# EAGLE design ElectricalOutlet (EAGLE 9.3.0)
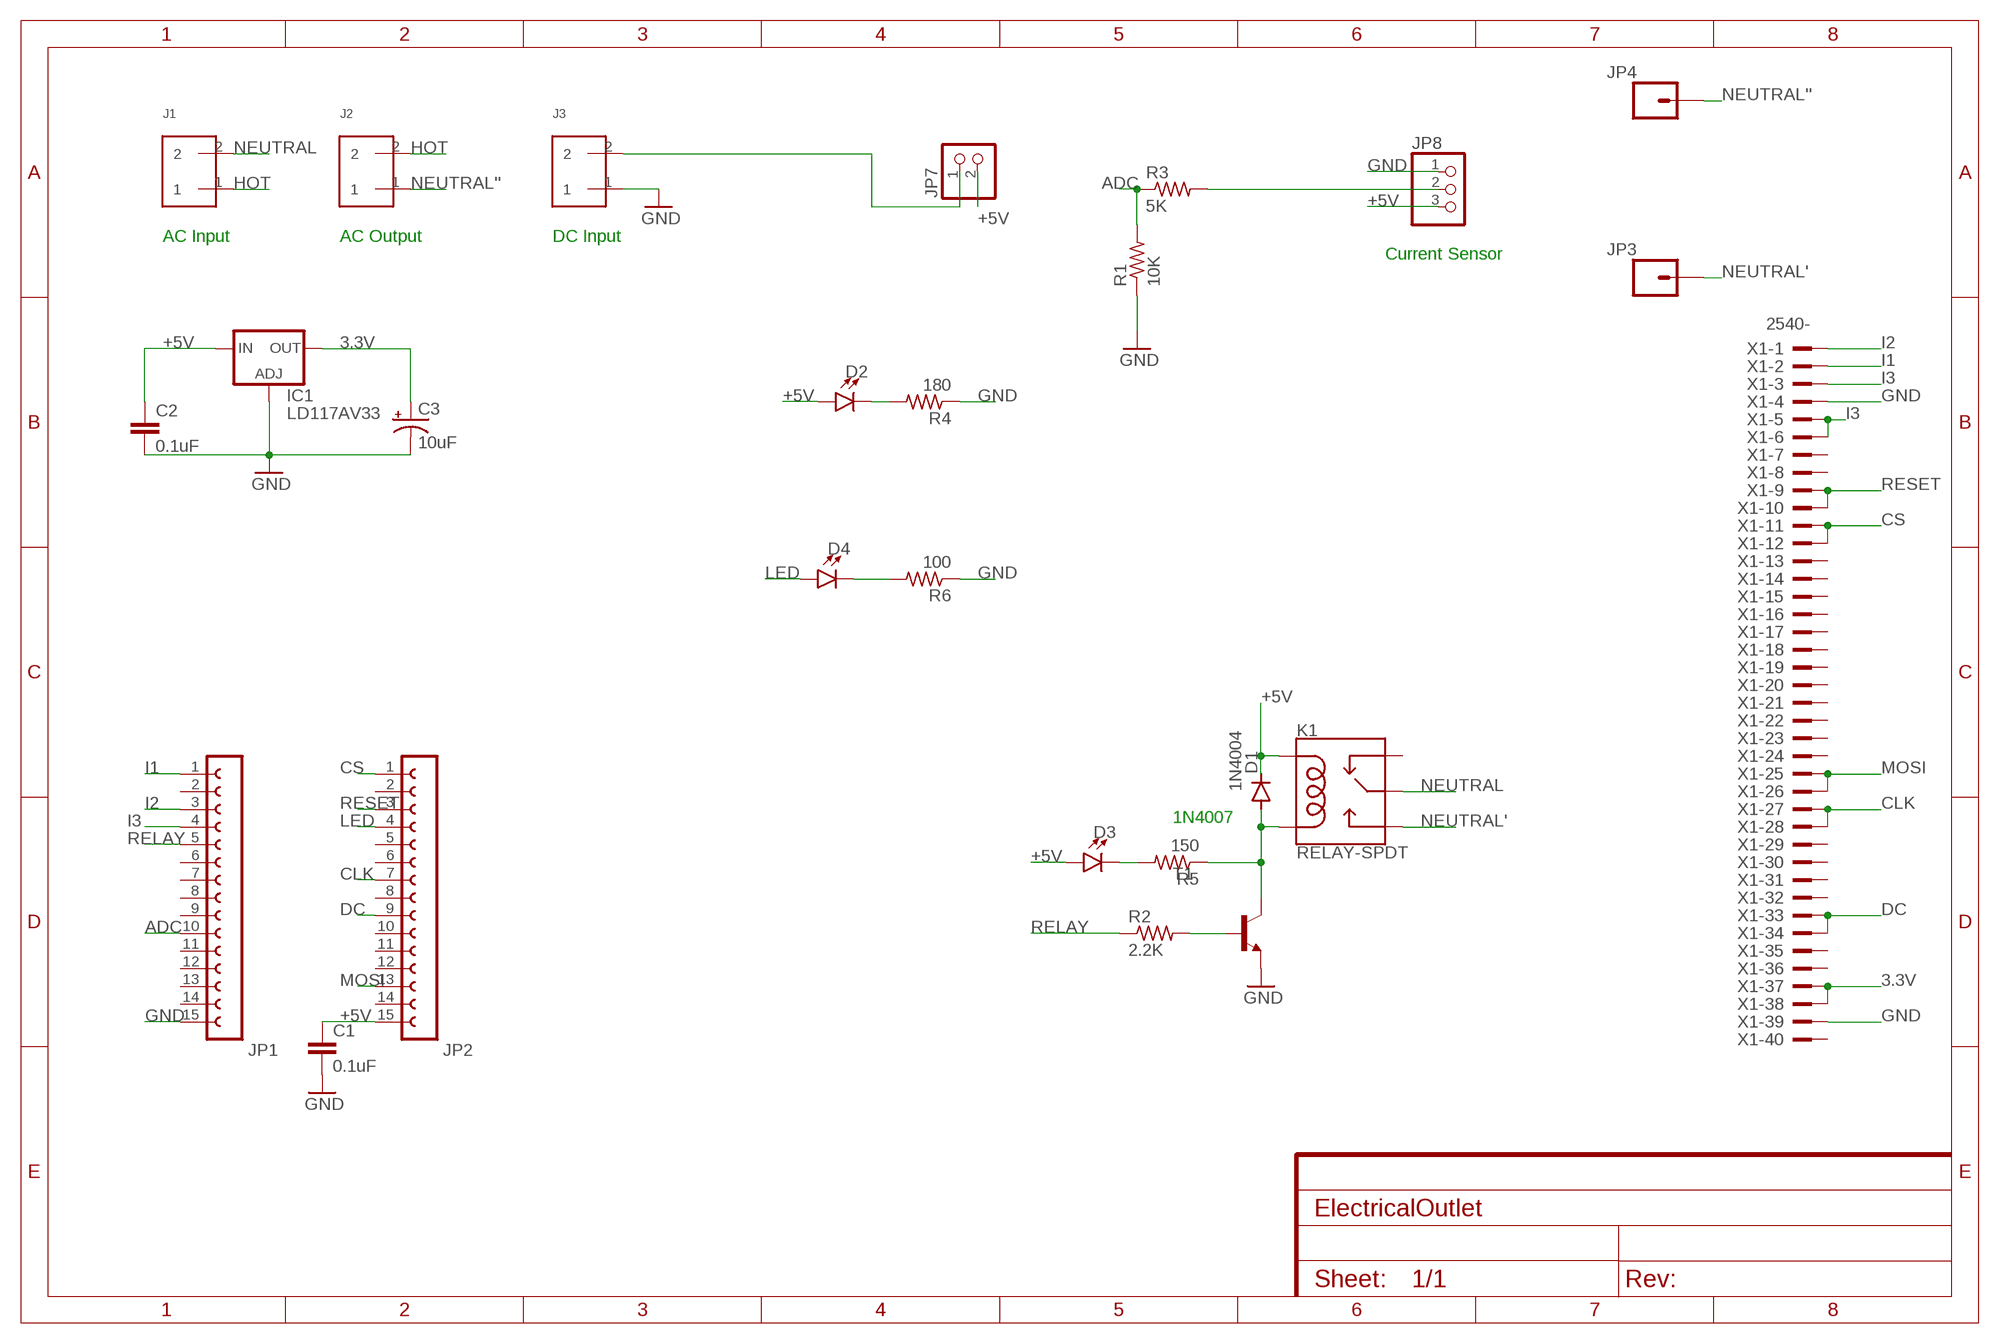
[diagram p0: schematic, sheet 1]

## Parts
C1  0.1uF  0.1UF-KIT-EZ-50V-20%  [CAP-PTH-SMALL-KIT]
C2  0.1uF  0.1UF-KIT-EZ-50V-20%  [CAP-PTH-SMALL-KIT]
C3  10uF  10UF-POLAR-RADIAL-2.5MM-KIT-25V-20%  [CPOL-RADIAL-2.5MM-5MM-KIT]
D1  1N4004  [DO41-10]
D2  LED3MM  [LED_3MM]
D3  LED3MM  [LED_3MM]
D4  LED3MM  [LED_3MM]
IC1  LD117AV33  [TO220L1]
J1  SCREW_TERMINAL  [PHEONIX-1935161]
J2  SCREW_TERMINAL  [PHEONIX-1935161]
J3  SCREW_TERMINAL  [PHEONIX-1935161]
JP1  FE15-1  [FE15]
JP2  FE15-1  [FE15]
JP3  CONN_01  [1X01]
JP4  CONN_01  [1X01]
JP7  PINHD-1X2  [1X02]
JP8  PINHD-1X3  [1X03]
K1  RELAY-SPDT  [RELAY_G5LE]
R1  10K  R-US_0204/7  [0204/7]
R2  2.2K  R-US_0204/7  [0204/7]
R3  5K  R-US_0204/7  [0204/7]
R4  180  R-US_0204/7  [0204/7]
R5  150  R-US_0204/7  [0204/7]
R6  100  R-US_0204/7  [0204/7]
T1  -NPN-TO92  [TO92]
X1  2540-  [PAK100/2500-40]

## Nets
3.3V: C3.1(+) IC1.2(OUT) X1.37 X1.38
+5V: C1.1 C2.1 D1.C D2.A D3.A IC1.3(IN) JP2.15 JP7.2 JP8.3 K1.2(COIL1)
ADC: JP1.10 R1.2 R3.1
CLK: JP2.7 X1.27 X1.28
CS: JP2.1 X1.11 X1.12
DC: JP2.9 X1.33 X1.34
GND: C1.2 C2.2 C3.2(-) IC1.1(ADJ) J3.1 JP1.15 JP8.1 R1.1 R4.1 R6.1 T1.1(E) X1.4 X1.39
HOT [AC]: J1.1 J2.2
I1: JP1.1 X1.2
I2: JP1.3 X1.1
I3: JP1.4 X1.3 X1.5 X1.6
LED: D4.A JP2.4
MOSI: JP2.13 X1.25 X1.26
N$2: D4.K(C) R6.2
N$3: R2.2 T1.2(B)
N$4: D3.K(C) R5.2
N$5: J3.2 JP7.1
N$6: D2.K(C) R4.2
N$7: JP8.2 R3.2
N$9: D1.A K1.5(COIL2) R5.1 T1.3(C)
NEUTRAL [AC]: J1.2 K1.1(MAIN)
NEUTRAL' [AC]: JP3.1 K1.3(NO)
NEUTRAL'' [AC]: J2.1 JP4.1
RELAY: JP1.5 R2.1
RESET: JP2.3 X1.9 X1.10
Unconnected: JP1.2 JP1.6 JP1.7 JP1.8 JP1.9 JP1.11 JP1.12 JP1.13 JP1.14 JP2.2 JP2.5 JP2.6 JP2.8 JP2.10 JP2.11 JP2.12 JP2.14 K1.4(NC) X1.7 X1.8 X1.13 X1.14 X1.15 X1.16 X1.17 X1.18 X1.19 X1.20 X1.21 X1.22 X1.23 X1.24 X1.29 X1.30 X1.31 X1.32 X1.35 X1.36 X1.40

## Notes on the sheet
- AC Input | AC Output | DC Input
- Current Sensor
- 1N4007

## Library data of the parts
C1 C2 = SparkFun-Capacitors:0.1UF: 0.1µF ceramic capacitors A capacitor is a passive two-terminal electrical component used to store electrical energy temporarily in an electric field.; PROD_ID: CAP-08370
C3 = SparkFun-Capacitors:10UF-POLAR: 10.0µF polarized capacitors A capacitor is a passive two-terminal electrical component used to store electrical energy temporarily in an electric field.; PROD_ID: CAP-08440
D1 = diode:1N4004: DIODE general purpose rectifier, 1 A
D2-D4 = SparkFun-LED:LED: LED (Generic) Standard schematic elements and footprints for 5mm, 3mm, 1206, and 0603 sized LEDs. Generic LEDs with no color specified.; PROD_ID: DIO-08794
IC1 = v-reg:LD117A?*: Low drop fixed and adjustable positive voltage regulators 1 A Source: http://www.st.com/stonline/products/literature/ds/7194/ld1117axx.pdf
J1-J3 = connector:SCREW_TERMINAL: PCB terminal block 5mm; DIGIKEY: 277-1667-ND
JP1 JP2 = con-lsta:FE15-1: FEMALE HEADER; OC_FARNELL: unknown; OC_NEWARK: unknown
JP3 JP4 = SparkFun-Connectors:CONN_01: Single connection point. Often used as Generic Header-pin footprint for 0.1 inch spaced/style header connections On any of the 0.1 inch spaced packages, you can populate with these: Break Away Headers - Straight <https://www.sparkfun.com/products/116> (PRT-00116) Break Away Male Headers - Right Angle <https://www.sparkfun.com/products/553> (PRT-00553) Female Headers <https://www.sparkfun.com/products/115> (PRT-00115) Break Away Headers - Machine Pin <https://www.sparkfun.com/products/117> (PRT-00117) Break Away Female Headers - Swiss Machine Pin <https://www.sparkfun.com/products/743> (PRT-00743) This device is also useful as a general connection point to wire up your design to another part of your project. Our various solder wires solder well into these plated through hole pads. Hook-Up Wire - Assortment (Stranded, 22 AWG) <https://www.sparkfun.com/products/11375> (PRT-11375) Hook-Up Wire - Assortment (Solid Core, 22 AWG) <https://www.sparkfun.com/products/11367> (PRT-11367) View the entire wire category on our website here <https://www.sparkfun.com/categories/141> Special notes: SMTSO-256-ET is a "flush mount" nut for a 4-40 screw. We mostly use this on specialty testbeds; it is a nice way to connect hardware to your PCB at an adjustable hieght. Also note, the SNAP packages are for using a snappable style connector. We sell a baggie of snaps and they are also used on two LilyPad designs: Snap Assortment - 30 pack (male and female) <https://www.sparkfun.com/products/11347> (DEV-11347) LilyPad Arduino SimpleSnap <https://www.sparkfun.com/products/10941> (DEV-10941) LilyPad SimpleSnap Protoboard <https://www.sparkfun.com/products/10940> (DEV-10940)
JP7 = pinhead:PINHD-1X2: PIN HEADER
JP8 = pinhead:PINHD-1X3: PIN HEADER
K1 = SparkFun-Electromechanical:RELAY-SPDT: SPDT Electromechanical Relay Single-pole, double-throw sealed relays. When current is applied to the coil, it throws a simple changeover switch, terminating the connection from the NC contact to ground and closing the NO contact. Use them to switch high voltage/high current devices. SparkFun Products JQX-15F: Relay SPDT Sealed - 20A <https://www.sparkfun.com/products/10924> (COM-10924) JZC-11F: Relay SPDT Sealed <https://www.sparkfun.com/products/100> (COM-00100); PROD_ID: COM-14146
R1-R6 = rcl:R-US_: RESISTOR, American symbol; SPICEPREFIX: R
T1 = transistor:*-NPN-: NPN Transistror BF959 corrected 2008.03.06
X1 = con-3m:2540-: 3M (TM) Pak 100 4-Wall Header Source: 3M; OC_FARNELL: unknown; OC_NEWARK: unknown

## Net classes
0 default: width 0.5 mm
1 AC: width 0.5 mm, clearance 3 mm to class 0, clearance 3 mm

## Board
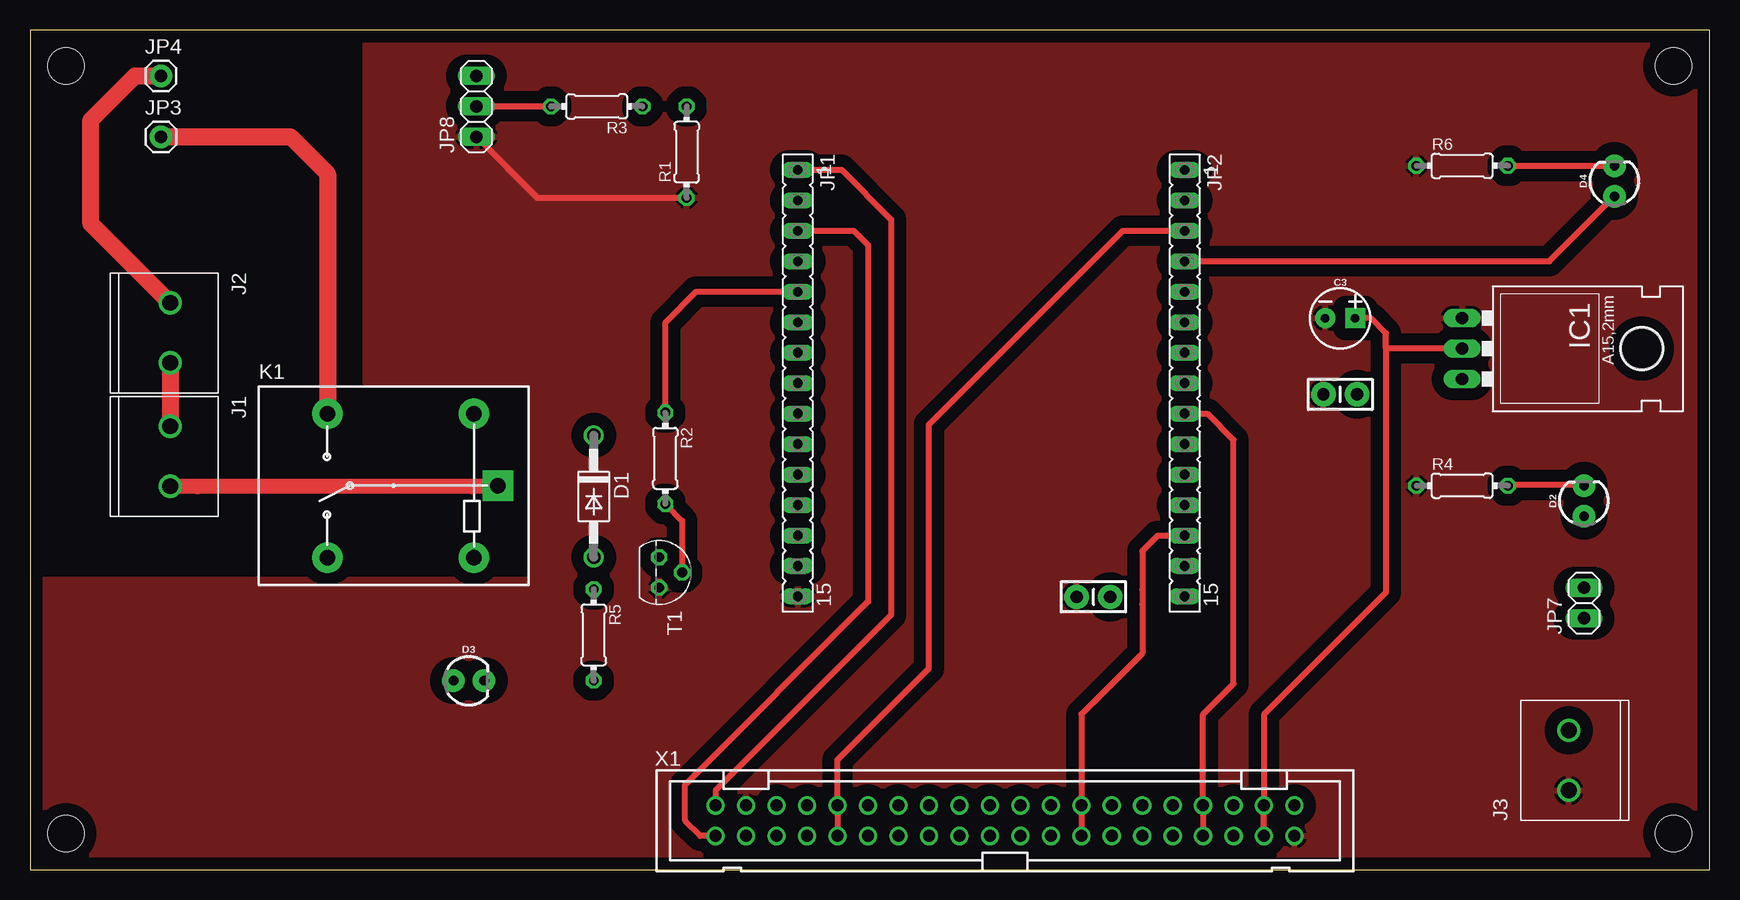
[diagram p1: board, top side]
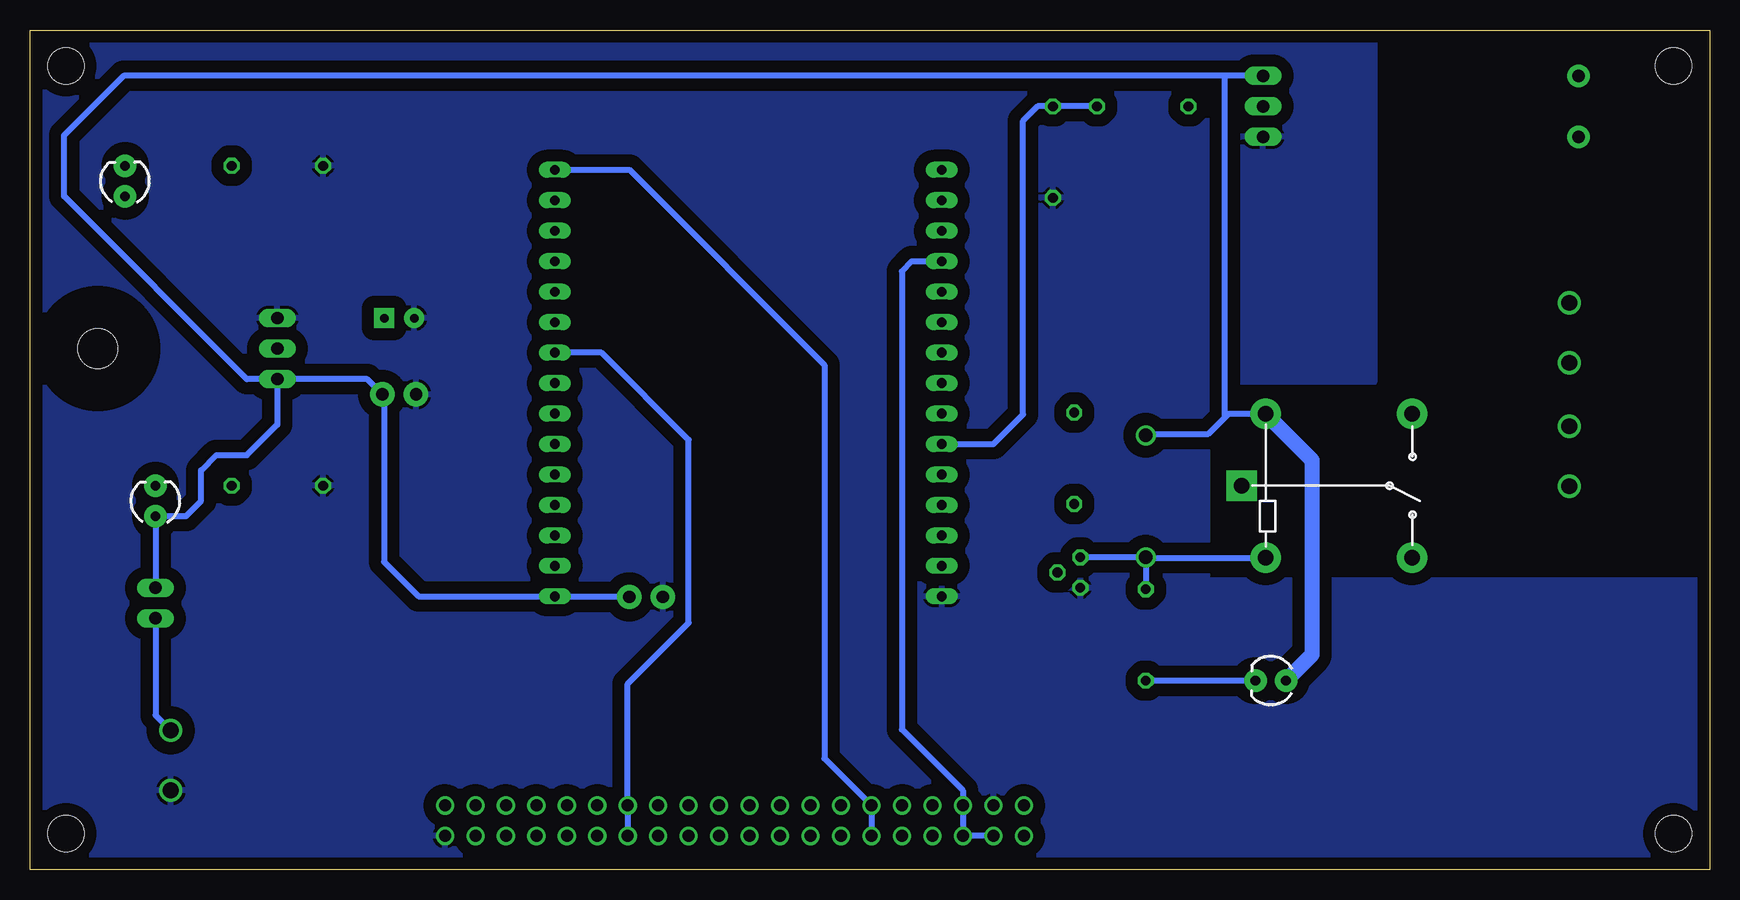
[diagram p2: board, bottom side, seen from below]

Size 140 x 70 mm. Coordinates in mm from the lower left corner, seen from the top.
Outline: 0,0 140,0 140,70 0,70 0,0
Copper layers (1*16): Top 0.035mm / dielectric 1.5mm / Bottom 0.035mm
Design rules "default *": minimum track width 0.4mm, minimum drill 0.35mm, track to track 0.5mm, track to pad 0.5mm, pad to pad 6mil, via to via 6mil, smd to smd 6mil, copper to edge 40mil, drill to drill 6mil, minimum pad ring 10mil, minimum via ring 8mil, stop-mask expansion 4mil, vias tented up to drill 0mil, thermal gap 10mil
Holes 3 mm at 3,67 3,3 137,67 137,3

### Footprints (pad centres in the part's own frame; a part is rotated, then mirrored left to right if it is on the bottom)
CAP-PTH-SMALL-KIT = drill 1.016 pad 2.032: 1 -1.397,0; 2 1.397,0
CPOL-RADIAL-2.5MM-5MM-KIT = drill 0.7 pad 1.651 square: 1 1.25,0 | drill 0.7 pad 1.651: 2 -1.25,0
DO41-10 = drill 1.118: A 5.08,0; C -5.08,0
LED_3MM = drill 0.813 pad 1.88: A -1.27,0; K 1.27,0
TO220L1 = drill 1.016 long: 1 -2.54,-3.81; 2 0,-3.81; 3 2.54,-3.81 | hole 3.302: 0,11.176
PHEONIX-1935161 = drill 1.3: 1 0,0; 2 5,0
FE15 = drill 0.813 long: 1 -17.78,0; 2 -15.24,0; 3 -12.7,0; 4 -10.16,0; 5 -7.62,0; 6 -5.08,0; 7 -2.54,0; 8 0,0; 9 2.54,0; 10 5.08,0; 11 7.62,0; 12 10.16,0; 13 12.7,0; 14 15.24,0; 15 17.78,0
1X01 = drill 1.016 pad 1.88: 1 0,0
1X02 = drill 1.016 long: 1 -1.27,0; 2 1.27,0
1X03 = drill 1.016 long: 1 -2.54,0; 2 0,0; 3 2.54,0
RELAY_G5LE = drill 1.3 pad 2.54 square: 1 8.52,-0.005 | drill 1.3 pad 2.54: 2 6.52,5.995; 3 -5.68,5.995; 4 -5.68,-6.005; 5 6.52,-6.005
0204/7 = drill 0.813 octagon: 1 -3.81,0; 2 3.81,0
TO92 = drill 0.813 octagon: 1 1.27,0; 2 0,1.905; 3 -1.27,0
PAK100/2500-40 = drill 1 pad 1.422: 1 -24.13,-1.27; 2 -24.13,1.27; 3 -21.59,-1.27; 4 -21.59,1.27; 5 -19.05,-1.27; 6 -19.05,1.27; 7 -16.51,-1.27; 8 -16.51,1.27; 9 -13.97,-1.27; 10 -13.97,1.27; 11 -11.43,-1.27; 12 -11.43,1.27; 13 -8.89,-1.27; 14 -8.89,1.27; 15 -6.35,-1.27; 16 -6.35,1.27; 17 -3.81,-1.27; 18 -3.81,1.27; 19 -1.27,-1.27; 20 -1.27,1.27; 21 1.27,-1.27; 22 1.27,1.27; 23 3.81,-1.27; 24 3.81,1.27; 25 6.35,-1.27; 26 6.35,1.27; 27 8.89,-1.27; 28 8.89,1.27; 29 11.43,-1.27; 30 11.43,1.27; 31 13.97,-1.27; 32 13.97,1.27; 33 16.51,-1.27; 34 16.51,1.27; 35 19.05,-1.27; 36 19.05,1.27; 37 21.59,-1.27; 38 21.59,1.27; 39 24.13,-1.27; 40 24.13,1.27

### Placement (x,y rotation side)
C1  88.65,22.73 180 top
C2  109.22,39.62 180 top
C3  109.22,45.97 0 top
D1  46.99,31.11 270 top
D2  129.54,30.73 90 top
D3  36.58,15.75 0 top
D4  132.08,57.4 90 top
IC1  123.19,43.43 270 top
J1  11.68,36.96 270 top
J2  11.68,47.24 270 top
J3  128.27,6.6 90 top
JP1  64,40.55 270 top
JP2  96.26,40.55 270 top
JP3  10.92,61.09 0 top
JP4  10.92,66.17 0 top
JP7  129.54,22.23 90 top
JP8  37.21,63.63 90 top
K1  30.48,32 0 top
R1  54.74,59.82 90 top
R2  52.96,34.29 270 top
R3  47.24,63.63 180 top
R4  119.38,32 0 top
R5  46.99,19.56 270 top
R6  119.38,58.67 0 top
T1  52.45,24.77 270 top
X1  81.28,4.06 0 top

### Tracks (layer width: path | path; a pad name or v marks a point on that pad's centre or on a via)
3.3V
  Top 0.5: X1.37 X1.38 102.87,12.95 113.03,23.11 113.03,43.43 | C3.1 111.76,45.97 113.03,44.7 113.03,43.43 | IC1.2 113.03,43.43
+5V
  Bottom 0.5: 40.41,37.7 40.41,66.17 JP8.3 132.21,66.17 137.16,61.21 137.16,56.13 121.92,40.89 IC1.3 | 40.41,37.7 40.11,38 K1.2 | 40.41,37.7 41.79,36.32 46.97,36.32 46.97,36.21 D1.C | 96.39,22.78 107.62,22.78 110.49,25.65 110.49,39.5 C2.1 111.89,40.89 IC1.3 | 96.39,22.78 JP2.15 | IC1.3 119.38,37.08 121.92,34.54 124.46,34.54 125.73,33.27 125.73,30.73 127,29.46 D2.A JP7.2 | C1.1 96.34,22.73 96.39,22.78
  Bottom 1.27: D3.A 33.14,17.91 33.14,34.14 K1.2
ADC
  Bottom 0.5: JP1.10 59.69,35.47 57.21,37.95 57.21,62.42 56,63.63 R1.2 R3.1
CLK
  Bottom 0.5: X1.27 X1.28 90.17,15.49 85.09,20.57 85.09,35.81 92.37,43.09 JP2.7
CS
  Bottom 0.5: JP2.1 90.04,58.33 73.78,42.08 73.78,9.26 X1.12 X1.11 69.97,2.88
DC
  Top 0.5: JP2.9 98.13,38.01 100.33,35.81 100.33,15.49 97.79,12.95 X1.34 X1.33
GND
  Top 0.5: 115.47,58.67 R6.1 | JP8.1 42.29,56.01 R1.1
  pour Top (isolate 1.016): 139.7,70.1 41.91,70.1 41.66,69.85 27.94,69.85 27.94,40.64 41.91,40.64 41.91,24.13 0,24.13 0,0 139.7,0.25
  pour Bottom (isolate 1.016): 139.7,70.1 41.87,70.1 41.61,69.85 27.94,69.85 27.94,40.64 41.91,40.64 41.91,24.13 0,24.13 -0.04,0 139.7,0.25
HOT
  Top 1.4: J2.2 J1.1
I1
  Top 0.5: 64,58.27 JP1.1 67.65,58.33 71.79,54.2 71.79,21.24 57.15,6.6 X1.2
I2
  Top 0.5: X1.1 55.88,2.79 54.61,4.06 54.61,7.08 69.86,22.34 69.86,52.05 68.67,53.25 JP1.3
I3
  Bottom 0.5: 59.7,2.88 X1.3 X1.5 X1.6 62.23,6.59 67.33,11.68 67.33,49.89 66.5,50.71 JP1.4
LED
  Top 0.5: JP2.4 126.66,50.71 D4.A
  Bottom 0.5: D4.A 131.74,55.79
MOSI
  Top 0.5: JP2.13 96.22,27.81 93.98,27.81 92.71,26.54 92.71,23.34 92.73,23.32 92.73,22.14 92.71,22.12 92.71,18.03 87.63,12.95 X1.26 X1.25
N$2
  Top 0.5: R6.2 123.3,58.67 131.95,58.67 D4.K
N$3
  Top 0.5: R2.2 54.36,29.08 T1.2
N$4
  Bottom 0.5: D3.K R5.2
N$5
  Bottom 0.5: JP7.1 129.54,12.87 J3.2
N$6
  Top 0.5: 129.5,32.08 129.46,32.08 | 129.46,32.08 123.27,32.08 R4.2 | D2.K 129.46,32.08
N$7
  Top 0.5: JP8.2 R3.2
N$9
  Bottom 0.5: D1.A T1.3 | D1.A 46.95,26 K1.5 | D1.A R5.1
NEUTRAL
  Top 0.5: K1.1 38.92,31.92 36.83,31.92 | J1.2 13.93,31.96 13.97,31.92
  Top 1.27: 38.98,31.92 36.83,31.92 13.97,31.92 11.74,31.92
NEUTRAL'
  Top 1.4: JP3.1 21.72,61.09 24.8,58 K1.3
NEUTRAL''
  Top 1.4: J2.1 5.08,53.85 5.08,62.48 8.76,66.17 JP4.1
RELAY
  Top 0.5: R2.1 52.96,45.59 55.54,48.17 JP1.5
RESET
  Top 0.5: X1.9 X1.10 67.31,9.14 74.93,16.76 74.93,37.08 91.1,53.25 JP2.3